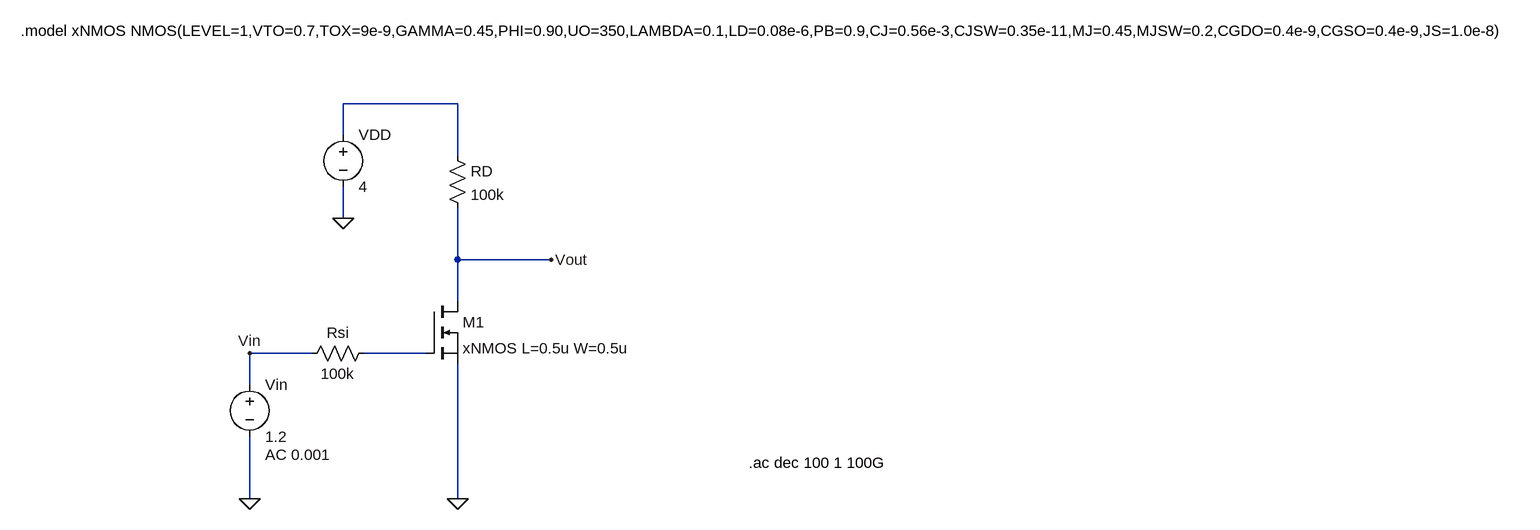
[diagram p0: schematic Chapter06A_01.fig.asc]
Chapter06A_01.fig.asc, the LTspice schematic file:
Version 4
SHEET 1 1952 740
WIRE 192 -80 16 -80
WIRE 16 -32 16 -80
WIRE 192 0 192 -80
WIRE 16 96 16 48
WIRE 192 160 192 80
WIRE 336 160 192 160
WIRE 192 224 192 160
WIRE -32 304 -128 304
WIRE 144 304 48 304
WIRE -128 352 -128 304
WIRE -128 528 -128 432
WIRE 192 528 192 320
FLAG -128 528 0
FLAG 192 528 0
FLAG 16 96 0
FLAG 336 160 Vout
FLAG -128 304 Vin
SYMBOL nmos 144 224 R0
SYMATTR InstName M1
SYMATTR Value xNMOS L=0.5u W=0.5u
SYMBOL res 64 288 R90
WINDOW 0 0 56 VBottom 2
WINDOW 3 32 56 VTop 2
SYMATTR InstName Rsi
SYMATTR Value 100k
SYMBOL res 176 -16 R0
SYMATTR InstName RD
SYMATTR Value 100k
SYMBOL voltage -128 336 R0
WINDOW 123 24 124 Left 2
WINDOW 39 0 0 Left 0
SYMATTR Value2 AC 0.001
SYMATTR InstName Vin
SYMATTR Value 1.2
SYMBOL voltage 16 -48 R0
WINDOW 123 0 0 Left 0
WINDOW 39 0 0 Left 0
SYMATTR InstName VDD
SYMATTR Value 4
TEXT -480 -192 Left 2 !.model xNMOS NMOS(LEVEL=1,VTO=0.7,TOX=9e-9,GAMMA=0.45,PHI=0.90,UO=350,LAMBDA=0.1,LD=0.08e-6,PB=0.9,CJ=0.56e-3,CJSW=0.35e-11,MJ=0.45,MJSW=0.2,CGDO=0.4e-9,CGSO=0.4e-9,JS=1.0e-8)
TEXT 640 472 Left 2 !.ac dec 100 1 100G

The netlist it stands for:
* Chapter06A_01.fig.asc
M1 Vout N002 0 0 xNMOS L=0.5u W=0.5u
Rsi N002 Vin 100k
RD N001 Vout 100k
Vin Vin 0 1.2 AC 0.001
VDD N001 0 4
.model NMOS NMOS
.model PMOS PMOS
.lib standard.mos
.model xNMOS NMOS(LEVEL=1,VTO=0.7,TOX=9e-9,GAMMA=0.45,PHI=0.90,UO=350,LAMBDA=0.1,LD=0.08e-6,PB=0.9,CJ=0.56e-3,CJSW=0.35e-11,MJ=0.45,MJSW=0.2,CGDO=0.4e-9,CGSO=0.4e-9,JS=1.0e-8)
.ac dec 100 1 100G
.backanno
.end